# Altium project 4U_PEE_V100.PrjPcb (part 3 of 3)
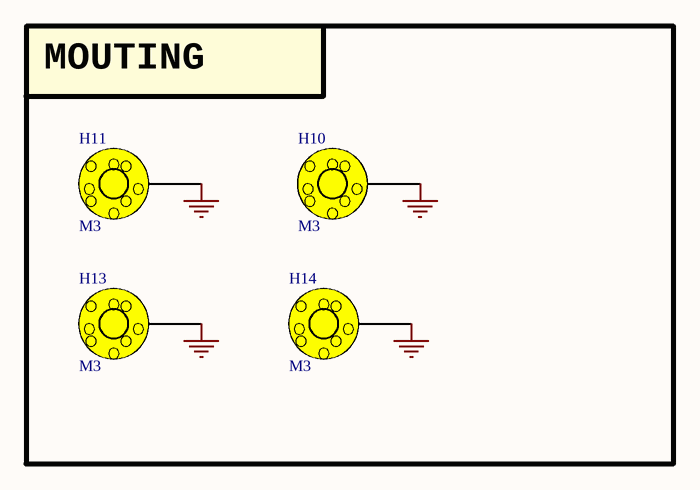
[diagram p23: MOUTING.SchDoc]

## Nets that join several sheets
+3.3_VBAT: 06_SOM (R304.1), 09_MRAM_RTC_WDT (C191.2 J19.1 U36.9)
+3.3V: 04_CONNECTOR_OUT (R299.1 R300.1 R301.1 R302.1), 05_POWER_2 (7 pins), 06_SOM_Console (C291.2 C293.2 U55.3 U57.3), 09_MRAM_RTC_WDT (25 pins), 10_NTC_TEMPSENSOR (17 pins), 12_TEC (15 pins), 13_FLOW_Sensor (36 pins), 14_HD4_PUMP (C109.2 R162.1 R163.1 U16.1)
+3.3V_MCU: 05_POWER_2 (C143.2 C144.2 VR2.2 VR2.4), 06_SOM_Console (C133.2 J17.1 R213.2 R214.2), 08_MCU (23 pins), 09_MRAM_RTC_WDT (C179.2 R398.2 U39.1)
+3.3V_SOM: 05_POWER (C7.2 C8.2 VR1.2 VR1.4), 07_USB (8 pins)
+3/5V_Solenoid: 05_POWER_2 (7 pins), 15_SOLEDNOID (8 pins)
+3V_SOLENOID: 05_POWER (7 pins), 05_POWER_2 (JP4.1)
+5V: 05_POWER_2 (9 pins), 10_NTC_TEMPSENSOR (C106.2 U14.1), 15_SOLEDNOID (R271.1 R274.1 R277.1 R280.1)
+5V_ADT2: 04_CONNECTOR_IN (D40.2 J1.9), 05_POWER (8 pins), 05_POWER_2 (13 pins)
+5V_HD4: 05_POWER_2 (7 pins), 14_HD4_PUMP (10 pins)
+5V_MCU: 05_POWER (R5.2), 05_POWER_2 (15 pins)
+5V_SAMA7: 05_POWER (9 pins), 06_SOM_USB_CARD (JP2.1)
+5V_TEC: 05_POWER_2 (7 pins), 12_TEC (20 pins)
+5V_USB_ADT1: 04_CONNECTOR_IN (C9.2 D2.5 D38.2 J1.4), 05_POWER (C3.2 JP1.1 R1.2 U1.5)
+5V_USB_ADT2: 04_CONNECTOR_IN (C10.2 D3.5 D39.2 J1.8), 05_POWER_2 (5 pins)
+12V_ADT2: 04_CONNECTOR_IN (D41.2 J1.10), 05_POWER_2 (8 pins)
+12V_Photo: 04_CONNECTOR_OUT (J22.1), 05_POWER_2 (7 pins)
GND: 04_CONNECTOR_IN (12 pins), 04_CONNECTOR_OUT (J22.2 J22.M1 J22.M2), 05_POWER (28 pins), 05_POWER_2 (81 pins), 06_SOM (35 pins), 06_SOM_USB_CARD (15 pins), 06_SOM_Console (19 pins), 07_eMMC (29 pins), 07_USB (20 pins), 08_MCU (49 pins), 09_MRAM_RTC_WDT (18 pins), 10_NTC_TEMPSENSOR (39 pins), 11_HEATER (11 pins), 12_TEC (66 pins), 13_FLOW_Sensor (34 pins), 14_HD4_PUMP (14 pins), 15_SOLEDNOID (22 pins), MOUTING (H10.1 H11.1 H13.1 H14.1)
VDD_3V3: 06_SOM (7 pins), 06_SOM_USB_CARD (17 pins), 06_SOM_Console (C132.2 J16.1 R209.2 R210.2), 07_eMMC (37 pins)
ADC_SWITCH: 08_MCU (R522.1), 12_TEC (8 pins)
ADC_TEMP1: 08_MCU (R100.2), 10_NTC_TEMPSENSOR (C88.2 R133.2)
ADC_TEMP2: 08_MCU (R104.2), 10_NTC_TEMPSENSOR (C93.2 R139.2)
ADC_TEMP3: 08_MCU (R297.1), 10_NTC_TEMPSENSOR (C99.2 R145.2)
ADC_TEMP4: 08_MCU (R520.1), 10_NTC_TEMPSENSOR (C103.2 R151.2)
ADC_TEMP5: 08_MCU (R524.2), 10_NTC_TEMPSENSOR (C90.2 R134.2)
ADC_TEMP6: 08_MCU (R523.2), 10_NTC_TEMPSENSOR (C95.2 R140.2)
ADC_TEMP7: 08_MCU (R521.1), 10_NTC_TEMPSENSOR (C101.2 R146.2)
ADC_TEMP8: 08_MCU (R526.2), 10_NTC_TEMPSENSOR (C105.2 R152.2)
ADT2_USB_D_N: 04_CONNECTOR_IN (D3.4), 08_MCU (U2.136)
ADT2_USB_D_P: 04_CONNECTOR_IN (D3.6), 08_MCU (U2.137)
HEATER_PWM_1: 08_MCU (R36.2), 11_HEATER (R125.1)
HEATER_PWM_2: 08_MCU (R9.2), 11_HEATER (R127.1)
HEATER_PWM_3: 08_MCU (R10.2), 11_HEATER (R129.1)
HEATER_PWM_4: 08_MCU (R35.2), 11_HEATER (R131.1)
MCU_CAN1_RX: 06_SOM_Console (U57.4), 08_MCU (R582.2)
MCU_CAN1_TX: 06_SOM_Console (U57.1), 08_MCU (R583.2)
MCU_CONSOLE_RX: 06_SOM_Console (J17.3 R214.1), 08_MCU (R291.1)
MCU_CONSOLE_TX: 06_SOM_Console (J17.2 R213.1), 08_MCU (R292.1)
MCU_FRAM_nCS: 08_MCU (R612.1), 09_MRAM_RTC_WDT (R614.1 U59.1)
MCU_HD4_I2C2_SCL: 08_MCU (R39.1), 14_HD4_PUMP (R106.2 R162.2)
MCU_HD4_I2C2_SDA: 08_MCU (R37.1), 14_HD4_PUMP (R163.2 R617.2)
MCU_HD4_I2C_EN: 08_MCU (R67.2), 14_HD4_PUMP (R168.1 U16.5)
MCU_I2C0_SCL: 08_MCU (R14.2), 13_FLOW_Sensor (6 pins)
MCU_I2C0_SDA: 08_MCU (R13.2), 13_FLOW_Sensor (6 pins)
MCU_MRAM_QSPI_CLK: 08_MCU (R24.2), 09_MRAM_RTC_WDT (U35.6)
MCU_MRAM_QSPI_IO0: 08_MCU (R23.2), 09_MRAM_RTC_WDT (U35.5)
MCU_MRAM_QSPI_IO1: 08_MCU (R21.2), 09_MRAM_RTC_WDT (U35.2)
MCU_MRAM_QSPI_IO2: 08_MCU (R27.2), 09_MRAM_RTC_WDT (U35.3)
MCU_MRAM_QSPI_IO3: 08_MCU (R43.1), 09_MRAM_RTC_WDT (U35.7)
MCU_PRAM_SPI1_nCS: 08_MCU (R78.2), 09_MRAM_RTC_WDT (R529.1 U37.2)
MCU_PRAM_SW_nEN: 08_MCU (R286.1), 09_MRAM_RTC_WDT (R397.1 U37.15)
MCU_RAM_QSPI_nCS: 08_MCU (R19.2), 09_MRAM_RTC_WDT (R388.1 U35.1)
MCU_RTC_CLKOUT: 08_MCU (R49.2), 09_MRAM_RTC_WDT (R389.1 U36.3)
MCU_RTC_INT: 08_MCU (R50.2), 09_MRAM_RTC_WDT (R390.1 U36.7)
MCU_SENSOR1_nIRQ: 08_MCU (R109.1), 13_FLOW_Sensor (R169.2)
MCU_SENSOR2_nIRQ: 08_MCU (R110.1), 13_FLOW_Sensor (R179.2)
MCU_SENSOR3_nIRQ: 08_MCU (R114.1), 13_FLOW_Sensor (R81.2)
MCU_SENSOR4_nIRQ: 08_MCU (R116.1), 13_FLOW_Sensor (R112.2)
MCU_SOL_1_IN1: 08_MCU (R12.2), 15_SOLEDNOID (U30.3)
MCU_SOL_1_IN2: 08_MCU (R69.2), 15_SOLEDNOID (U30.2)
MCU_SOL_2_IN1: 08_MCU (R290.1), 15_SOLEDNOID (U31.3)
MCU_SOL_2_IN2: 08_MCU (R616.1), 15_SOLEDNOID (U31.2)
MCU_SOL_3_IN1: 08_MCU (R32.2), 15_SOLEDNOID (U32.3)
MCU_SOL_3_IN2: 08_MCU (R30.2), 15_SOLEDNOID (U32.2)
MCU_SOL_4_IN1: 08_MCU (R34.2), 15_SOLEDNOID (U33.3)
MCU_SOL_4_IN2: 08_MCU (R33.2), 15_SOLEDNOID (U33.2)
MCU_SPI1_MISO: 08_MCU (R76.2), 09_MRAM_RTC_WDT (U37.14)
MCU_SPI1_MOSI: 08_MCU (R77.2), 09_MRAM_RTC_WDT (U37.11)
MCU_SPI1_SCK: 08_MCU (R74.2), 09_MRAM_RTC_WDT (U37.5)
MCU_USART_RXD2: 08_MCU (R287.1), 09_MRAM_RTC_WDT (U59.2), 12_TEC (U5.18 U6.18 U7.18 U8.18)
MCU_USART_SCK2: 08_MCU (R289.1), 09_MRAM_RTC_WDT (U59.6), 12_TEC (U5.16 U6.16 U7.16 U8.16)
MCU_USART_TXD2: 08_MCU (R288.1), 09_MRAM_RTC_WDT (U59.5), 12_TEC (U5.17 U6.17 U7.17 U8.17)
NRST: 06_SOM (U34.105), 09_MRAM_RTC_WDT (R394.1)
POW_ONOFF_5V: 05_POWER_2 (R237.2), 08_MCU (R51.1)
POW_ONOFF_HD4: 05_POWER_2 (R267.2), 08_MCU (R73.1)
POW_ONOFF_Laser: 05_POWER_2 (R250.2), 08_MCU (R186.1)
POW_ONOFF_Photo: 05_POWER_2 (R238.2), 08_MCU (R185.1)
POW_ONOFF_Solenoid: 05_POWER_2 (R225.2), 08_MCU (R75.1)
POW_ONOFF_SOM: 05_POWER (R4.2), 08_MCU (R26.1)
POW_ONOFF_TEC: 05_POWER_2 (R258.2), 08_MCU (R52.1)
SENSOR1_EN: 08_MCU (R55.2), 13_FLOW_Sensor (R178.1 U17.5)
SENSOR2_EN: 08_MCU (R57.2), 13_FLOW_Sensor (R182.1 U18.5)
SENSOR3_EN: 08_MCU (R38.2), 13_FLOW_Sensor (R111.1 U49.5)
SENSOR4_EN: 08_MCU (R40.2), 13_FLOW_Sensor (R507.1 U50.5)
SENSOR5_EN: 08_MCU (R58.2), 13_FLOW_Sensor (R190.1 U19.5)
SENSOR_I2C1_SCL: 08_MCU (R62.1), 09_MRAM_RTC_WDT (R118.1 R391.1), 12_TEC (R117.1)
SENSOR_I2C1_SDA: 08_MCU (R59.1), 09_MRAM_RTC_WDT (R392.1 R620.1), 12_TEC (R79.1)
TEC_nCS_1: 08_MCU (R68.2), 12_TEC (R97.2 U5.15)
TEC_nCS_2: 08_MCU (R70.2), 12_TEC (R107.2 U7.15)
TEC_nCS_3: 08_MCU (R72.2), 12_TEC (R98.2 U6.15)
TEC_nCS_4: 08_MCU (R20.1), 12_TEC (R108.2 U8.15)
TEC_SWEN_1: 08_MCU (R41.2), 12_TEC (R103.1 U5.13)
TEC_SWEN_2: 08_MCU (R285.1), 12_TEC (R113.1 U7.13)
TEC_SWEN_3: 08_MCU (R47.2), 12_TEC (R105.1 U6.13)
TEC_SWEN_4: 08_MCU (R48.2), 12_TEC (R115.1 U8.13)
TEMP _SENSOR: 08_MCU (R527.2), 10_NTC_TEMPSENSOR (R157.2)
WD_DONE: 08_MCU (R293.1), 09_MRAM_RTC_WDT (U39.4)
WD_nRESET: 08_MCU (R45.2), 09_MRAM_RTC_WDT (R394.2 R400.1)
WD_WAKE: 08_MCU (R294.1), 09_MRAM_RTC_WDT (U39.5)